# EAGLE design CircuitRiver - RPi-Basic Stream (EAGLE 7.5.0)
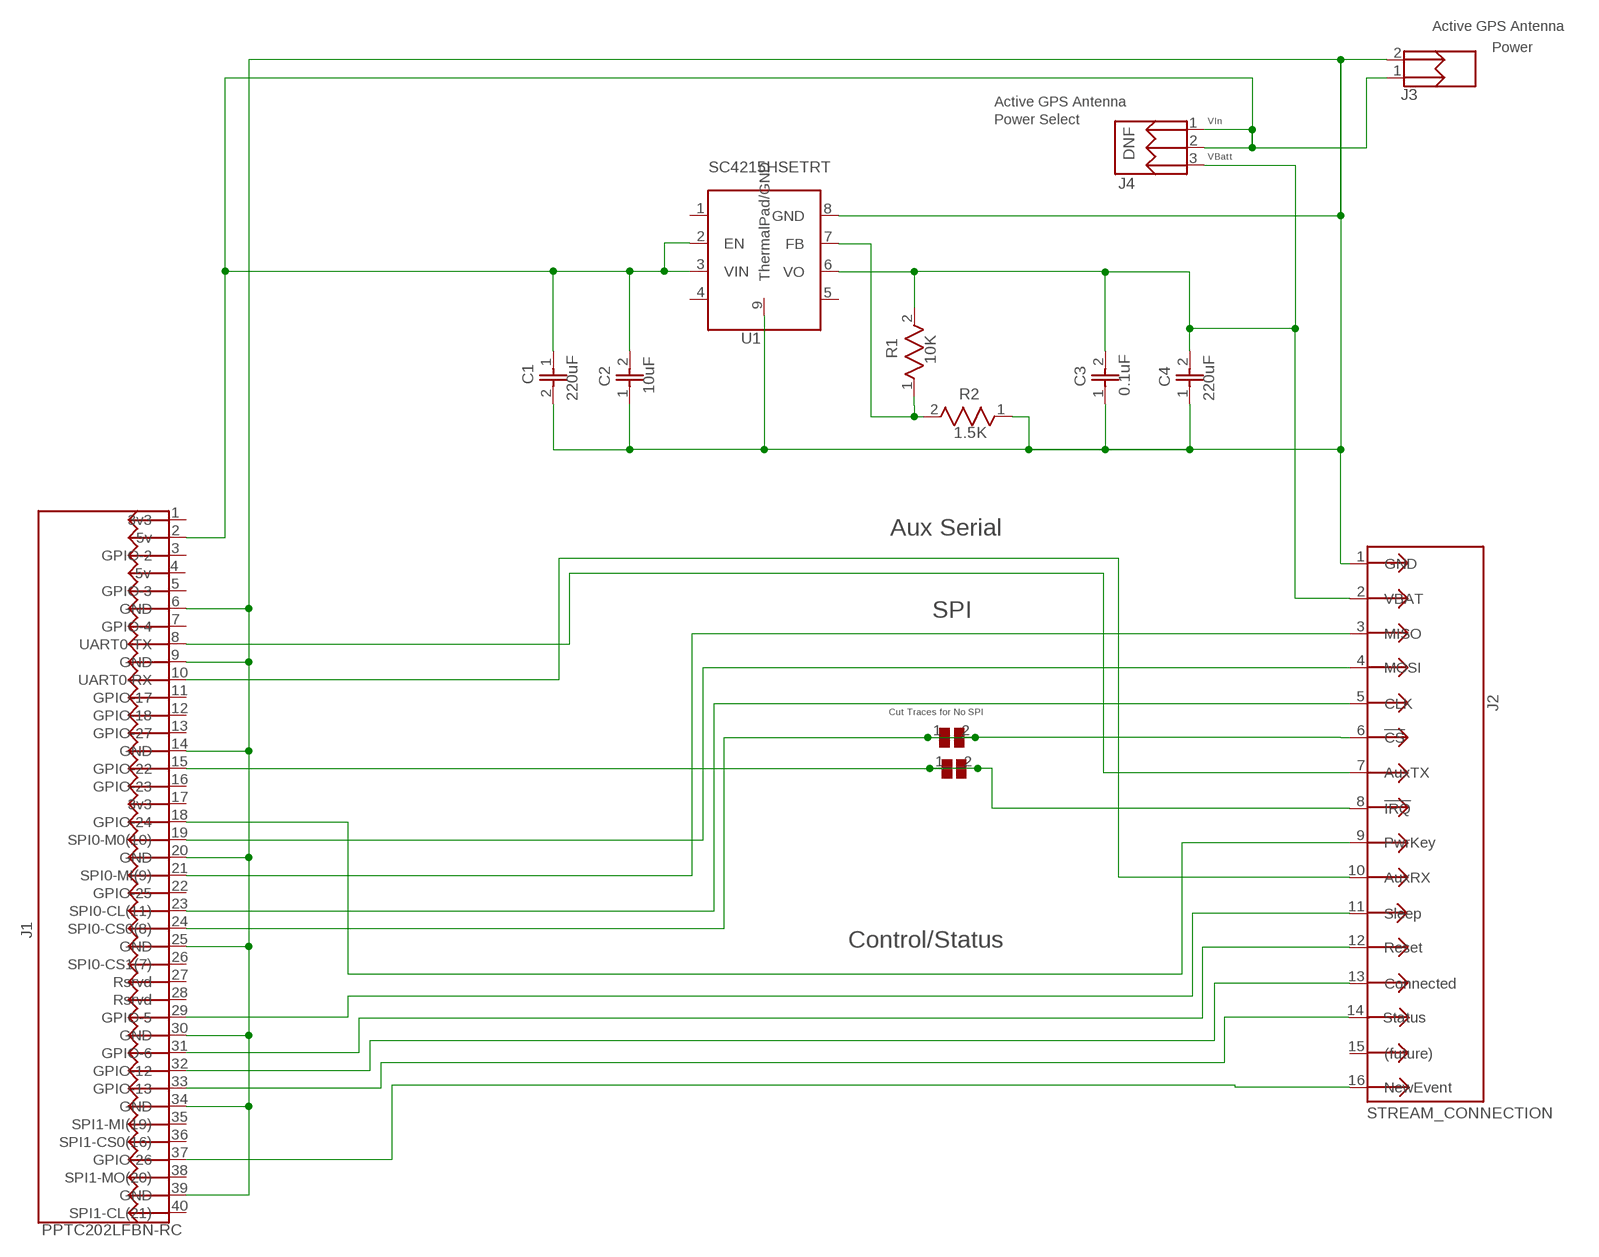
[diagram p0: schematic, sheet 1]

## Parts
C1  220uF  CAP_1206_NP  [CAP_1206]
C2  10uF  CAP_0603_NP  [CAP_0603]
C3  0.1uF  DEV_C3  [0402_NP]
C4  220uF  CAP_1206_NP  [CAP_1206]
J1  PPTC202LFBN-RC  R-PI_GPIO_HEADER  [HDR-2x20T/2.54x2.54/51x5]
J2  STREAM_CONNECTION  [HDR-2x8T/2x2/16x4]
J3  JST_PH-2_T/H  [JST_PH-2_T/H]
J4  DNF  3PIN_T/H_HEADER  [HDR-1x3T/2/6x2]
LG1  LOOUQ_LOGO  [LooUQ-6mm]
LG2  CIRCUITRIVER_LOGO  [CircuitRiver-6mm]
R1  10K  RES_0603  [RES_0603]
R2  1.5K  RES_0603  [RES_0603]
TJ1  NoMount  TRACE_JUMPER  [TraceJumper]
TJ2  NoMount  TRACE_JUMPER  [TraceJumper]
U1  SC4215HSETRT  SC4215H_LDO  [SOIC-8EP/150mil]

## Nets
GND: C1.2 C2.1 C3.1 C4.1 J1.6(GND) J1.9(GND) J1.14(GND) J1.20(GND) J1.25(GND) J1.30(GND) J1.34(GND) J1.39(GND) J2.1(GND) J3.2 R2.1 U1.8(GND) U1.9(ThermalPad/GND)
Net_2: R1.1 R2.2 U1.7(FB)
Net_4: J1.19(SPI0-M0(10)) J2.4(MOSI)
Net_5: J1.21(SPI0-MI(9)) J2.3(MISO)
Net_6: J1.23(SPI0-CL(11)) J2.5(CLK)
Net_7: J1.24(SPI0-CS0(8)) J2.6(!CS) TJ1.1 TJ1.2
Net_8: J1.31(GPIO-6) J2.12(Reset)
Net_9: J1.33(GPIO-13) J2.14(Status)
Net_10: J1.18(GPIO-24) J2.9(PwrKey)
Net_11: J1.15(GPIO-22) J2.8(!IRQ) TJ2.1 TJ2.2
Net_12: J1.8(UART0-TX) J2.7(AuxTX)
Net_13: J1.10(UART0-RX) J2.10(AuxRX)
Net_14: J1.29(GPIO-5) J2.11(Sleep)
Net_15: J1.32(GPIO-12) J2.13(Connected)
Net_16: J1.37(GPIO-26) J2.16(NewEvent)
Pwr5v0: C1.1 C2.2 J1.2(5v) J3.1 J4.1 J4.2 U1.2(EN) U1.3(VIN)
VBAT: C3.2 C4.2 J2.2(VBAT) J4.3 R1.2 U1.6(VO)
Unconnected: J1.1(3v3) J1.3(GPIO-2) J1.4(5v) J1.5(GPIO-3) J1.7(GPIO-4) J1.11(GPIO-17) J1.12(GPIO-18) J1.13(GPIO-27) J1.16(GPIO-23) J1.17(3v3) J1.22(GPIO-25) J1.26(SPI0-CS1(7)) J1.27(Rsrvd) J1.28(Rsrvd) J1.35(SPI1-MI(19)) J1.36(SPI1-CS0(16)) J1.38(SPI1-MO(20)) J1.40(SPI1-CL(21)) J2.15((future)) U1.1(NC) U1.4(NC) U1.5(NC)

## Notes on the sheet
- Active GPS Antenna
- Power
- Active GPS Antenna
- Power Select
- VIn
- VBatt
- Aux Serial
- SPI
- Cut Traces for No SPI
- Control/Status

## Library data of the parts
C1 C4 = common:CAP_1206_NP; DATASHEET: https://search.murata.co.jp/Ceramy/image/img/A01X/G101/ENG/GRM31CR60J227ME11-01.pdf; MANUFACTURER: Murata; MFGPARTNM: GRM31CR60J227ME11L
C2 = common:CAP_0603_NP; MANUFACTURER: Samsung; MFGPARTNM: CL10A106MQ8NNNC
C3 = common:DEV_C3; MANUFACTURER: Samsung; MFGPARTNM: CL10B104KB8NNNC
J1 = common:R-PI_GPIO_HEADER; ALT-DIGIKEYPARTNM: 1528-1385-ND; DATASHEET: https://drawings-pdf.s3.amazonaws.com/10492.pdf; DESCRIPTION: CONN HDR 40POS 0.1 TIN PCB; MANUFACTURER: Sullins; MFGPARTNM: PPTC202LFBN-RC
J2 = common:STREAM_CONNECTION; DATASHEET: https://cdn.harwin.com/pdfs/M22-204.pdf; MANUFACTURER: Harwin; MFGPARTNM: M22-2040805
J3 = common:JST_PH-2_T/H; DATASHEET: http://www.jst-mfg.com/product/pdf/eng/ePH.pdf; MANUFACTURER: JST; MFGPARTNM: S2B-PH-K-S(LF)(SN)
J4 = common:3PIN_T/H_HEADER; DATASHEET: https://media.digikey.com/pdf/Data%20Sheets/3M%20PDFs/951yyy-xx22-AR_Series%20Datasheet.pdf; MANUFACTURER: 3M; MFGPARTNM: 951103-8622-AR
LG1 = common:LOOUQ_LOGO
LG2 = common:CIRCUITRIVER_LOGO
R1 = common:RES_0603; MANUFACTURER: Stackpole; MFGPARTNM: RNCP0603FTD10K0
R2 = common:RES_0603; MANUFACTURER: Stackpole; MFGPARTNM: RNCP0603FTD10K0; VALUE: 10K
TJ1 TJ2 = common:TRACE_JUMPER; DESCRIPTION: Cutable trace jumper
U1 = common:SC4215H_LDO; DATASHEET: https://www.semtech.com/uploads/documents/sc4215a.pdf; DESCRIPTION: IC REG LINEAR POS ADJ 2A 8SOIC; MANUFACTURER: Semtech; MFGPARTNM: SC4215HSETRT

## Board
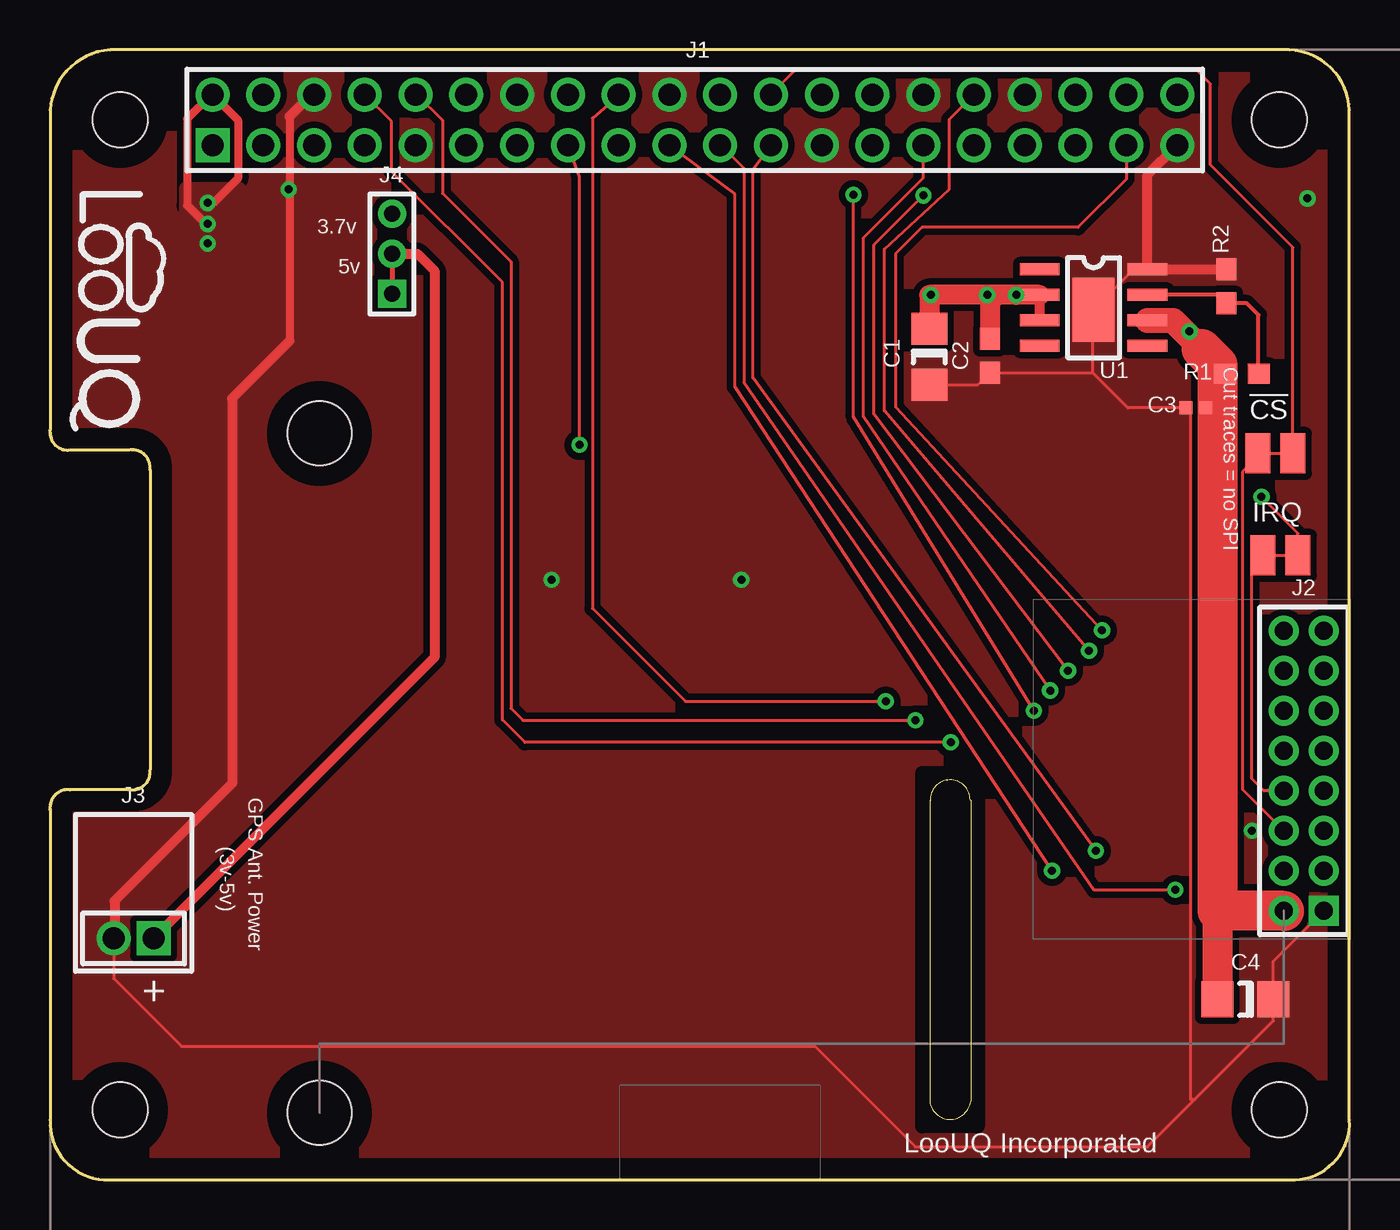
[diagram p1: board, top side]
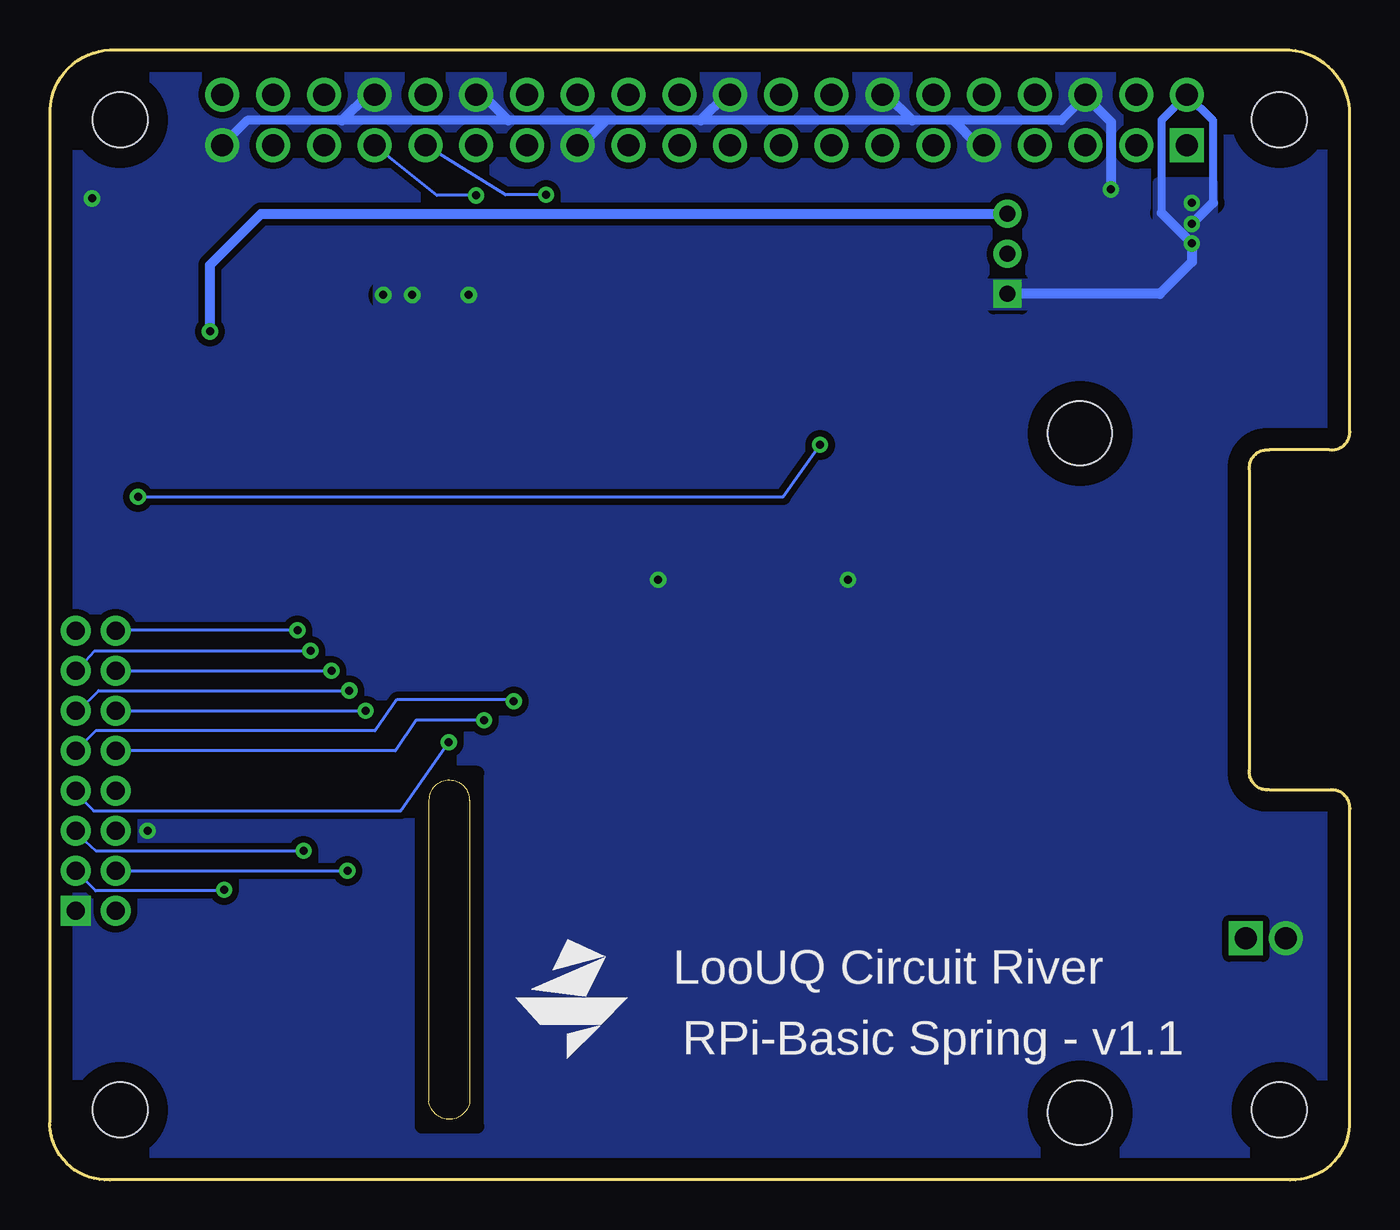
[diagram p2: board, bottom side, seen from below]

Size 65.01 x 56.5 mm. Coordinates in mm from the lower left corner, seen from the top.
Outline: 0.01,3 arc95 2.98,0 62.01,0 arc97 65.01,3 65.01,53.5 arc86 62.01,56.5 3.01,56.5 arc82 0.01,53.5 0.01,37.5 arc106 1.01,36.5 4.01,36.5 arc-103 5.01,35.5 5.01,20.5 arc-102 4.01,19.5 1.01,19.5 arc106 0.01,18.5 0.01,3
Copper layers (1*16): Top 0.035mm / dielectric 1.5mm / Bottom 0.035mm
Design rules "default *": minimum track width 10mil, minimum drill 0.61mm, track to track 8mil, track to pad 8mil, pad to pad 8mil, via to via 8mil, smd to smd 8mil, copper to edge 40mil, drill to drill 8mil, minimum pad ring 0mil, minimum via ring 8mil, stop-mask expansion 4mil, vias tented up to drill 16mil, thermal gap 10mil
Holes 3.2 mm at 13.48,3.35 13.48,37.33
Holes 2.75 mm at 61.51,53 3.51,53 3.51,3.5 61.51,3.5
tRestrict: 4 lines
bRestrict: 4 lines
Milling: 4 lines

### Footprints (pad centres in the part's own frame; a part is rotated, then mirrored left to right if it is on the bottom)
CAP_1206 = smd 1.6 x 1.8: 1 -1.4,0; 2 1.4,0
CAP_0603 = smd 1.1 x 1: 1 -0.85,0; 2 0.85,0
0402_NP = smd 0.65 x 0.65: 1 -0.48,0; 2 0.48,0
CAP_1206_C4 = smd 1.6 x 1.8: 1 -1.4,0; 2 1.4,0
HDR-2x20T/2.54x2.54/51x5 = drill 1.1 pad 1.7 square: 1 -24.13,-1.27 | drill 1.1 pad 1.7: 2 -24.13,1.27; 3 -21.59,-1.27; 4 -21.59,1.27; 5 -19.05,-1.27; 6 -19.05,1.27; 7 -16.51,-1.27; 8 -16.51,1.27; 9 -13.97,-1.27; 10 -13.97,1.27; 11 -11.43,-1.27; 12 -11.43,1.27; 13 -8.89,-1.27; 14 -8.89,1.27; 15 -6.35,-1.27; 16 -6.35,1.27; 17 -3.81,-1.27; 18 -3.81,1.27; 19 -1.27,-1.27; 20 -1.27,1.27; 21 1.27,-1.27; 22 1.27,1.27; 23 3.81,-1.27; 24 3.81,1.27; 25 6.35,-1.27; 26 6.35,1.27; 27 8.89,-1.27; 28 8.89,1.27; 29 11.43,-1.27; 30 11.43,1.27; 31 13.97,-1.27; 32 13.97,1.27; 33 16.51,-1.27; 34 16.51,1.27; 35 19.05,-1.27; 36 19.05,1.27; 37 21.59,-1.27; 38 21.59,1.27; 39 24.13,-1.27; 40 24.13,1.27
HDR-2x8T/2x2/16x4 = drill 0.9 pad 1.5 square: 1 -7,-1 | drill 0.9 pad 1.5: 2 -7,1; 3 -5,-1; 4 -5,1; 5 -3,-1; 6 -3,1; 7 -1,-1; 8 -1,1; 9 1,-1; 10 1,1; 11 3,-1; 12 3,1; 13 5,-1; 14 5,1; 15 7,-1; 16 7,1
JST_PH-2_T/H = drill 1.1 pad 1.7 square: 1 0,-1 | drill 1.1 pad 1.7: 2 0,1
HDR-1x3T/2/6x2 = drill 0.8 pad 1.4 square: 1 -2,0 | drill 0.8 pad 1.4: 2 0,0; 3 2,0
RES_0603 = smd 1.1 x 1: 1 -0.85,0; 2 0.85,0
TraceJumper = smd 1.25 x 2: 1 -0.875,0; 2 0.875,0
SOIC-8EP/150mil = smd 2 x 0.6: 1 -2.7,1.905; 2 -2.7,0.635; 3 -2.7,-0.635; 4 -2.7,-1.905; 5 2.7,-1.905; 6 2.7,-0.635; 7 2.7,0.635; 8 2.7,1.905 | smd 2.1 x 3.2: 9 0,-0.1

### Placement (x,y rotation side)
C1  43.98,41.15 270 top
C2  47.01,41.2 90 top
C3  57.31,38.6 0 top
C4  220uF  [CAP_1206_C4]  59.81,9.03 180 top
J1  R-PI GPIO HEADER  [HDR-2x20T/2.54x2.54/51x5]  32.26,53 0 top
J2  STREAM CONNECTION  [HDR-2x8T/2x2/16x4]  62.73,20.45 90 top
J3  JST PH-2 T/H  [JST_PH-2_T/H]  4.18,12.08 90 top
J4  17.11,46.3 90 top
Keepout_1  1  [ROUTE_KEEPOUT_1]  45.02,11.52 0 top
LG1  LOOUQ LOGO  [LooUQ-6mm]  3.35,43.43 270 top
LG2  CIRCUITRIVER LOGO  [CircuitRiver-6mm]  38.91,9.05 0 bottom
R1  59.63,40.3 180 top
R2  58.86,44.68 270 top
TJ1  61.31,36.33 0 top
TJ2  61.56,31.23 0 top
U1  52.21,43.62 0 top

### Tracks (layer width: path | path; a pad name or v marks a point on that pad's centre or on a via)
GND  (via drill 0.4 pad 0.8)
  Top 0.15: U1.8 54.21,45.53 U1.9 52.18,43.5 52.18,40.35 | C1.2 46.41,39.75 C2.1 52.18,40.35 | 52.18,40.35 53.93,38.6 C3.1 57.08,38.35 57.08,4 57.25,4 | J3.2 3.18,10.08 6.58,6.68 38.26,6.68 43.28,1.65 54.91,1.65 57.25,4 | 57.25,4 61.21,7.95 C4.1 61.21,10.93 J2.1
  Top 0.4: 11.98,53.18 11.98,49.53 | 11.98,49.53 11.98,41.95 | v11.93,49.53 11.98,49.53
  Top 0.5: J1.6 13.08,54.27 11.98,53.18 | 11.98,41.95 9.11,39.08 9.11,19.83 3.23,13.95 3.23,12.08 J3.2 | R2.1 U1.8 54.91,50.25 J1.39
  Bottom 0.45: J1.6 13.21,54.18 14.41,52.98 19.83,52.98 21.87,52.98 32.46,52.98 37.2,52.98 42.09,52.98 50.4,52.98 55.14,52.98 J1.39
  Bottom 0.5: J1.9 18.58,51.73 19.83,52.98 | J1.14 23.16,54.27 21.87,52.98 | J1.20 31.17,54.27 32.46,52.98 | J1.25 38.44,51.73 37.2,52.98 | J1.30 43.38,54.27 42.09,52.98 | J1.34 49.1,54.27 50.4,52.98 | J1.6 13.21,54.18 11.93,52.9 v11.93,49.53
  other vias: 34.58,30 25.08,30 62.91,49.08 60.13,17.45
  pour Top (isolate 0.33, no thermals): 0.99,3.05 1.04,2.44 1.22,1.96 1.53,1.54 1.95,1.23 2.43,1.04 3.03,0.98 61.97,0.98 62.58,1.03 63.07,1.22 63.48,1.53 63.79,1.94 63.98,2.43 64.03,3.04 64.03,53.42 63.94,53.99 63.73,54.48 63.4,54.89 62.98,55.22 62.49,55.43 61.93,55.53 3.1,55.53 2.55,55.42 2.06,55.2 1.64,54.87 1.31,54.45 1.09,53.96 0.99,53.41 0.99,37.51 0.99,37.48 1.01,37.48 4.03,37.48 4.46,37.46 4.99,37.28 5.45,36.94 5.78,36.49 5.97,35.96 5.99,35.52 5.99,20.48 5.97,20.05 5.78,19.52 5.45,19.07 4.99,18.73 4.47,18.54 4.03,18.53 1.01,18.53 0.99,18.52 0.99,18.5
  pour Bottom (isolate 0.33, no thermals): 0.99,3.05 1.04,2.44 1.22,1.96 1.53,1.54 1.95,1.23 2.43,1.04 3.03,0.98 61.97,0.98 62.58,1.03 63.07,1.22 63.48,1.53 63.79,1.94 63.98,2.43 64.03,3.04 64.03,53.42 63.94,53.99 63.73,54.48 63.4,54.89 62.98,55.22 62.49,55.43 61.93,55.53 3.1,55.53 2.55,55.42 2.06,55.2 1.64,54.87 1.31,54.45 1.09,53.96 0.99,53.41 0.99,37.51 0.99,37.48 1.01,37.48 4.03,37.48 4.46,37.46 4.99,37.28 5.45,36.94 5.78,36.49 5.97,35.96 5.99,35.52 5.99,20.48 5.97,20.05 5.78,19.52 5.45,19.07 4.99,18.73 4.47,18.54 4.03,18.53 1.01,18.53 0.99,18.52 0.99,18.5
  pour Top (isolate 0.33, no thermals): 51.18,46.08 51.2,41.17 53.27,41.17 53.27,46.06
  pour Top (isolate 0.33, no thermals): 63.28,13.94 64.22,13.94 64.22,11.97 63.28,11.97
Net_2
  Top 0.2: R1.1 60.46,40.3 60.46,43.25 59.88,43.83 R2.2 58.86,44.26 U1.7
Net_4  (via drill 0.4 pad 0.8)
  Top 0.15: v50.13,15.45 34.26,39.66 34.26,49.31 J1.19
  Bottom 0.15: J2.4 v50.13,15.45
Net_5  (via drill 0.4 pad 0.8)
  Top 0.15: J1.21 33.55,51.73 34.71,50.58 34.71,39.88 52.23,14.5 v56.29,14.5
  Bottom 0.15: v56.29,14.5 56.29,14.45 62.73,14.45 J2.3
Net_6  (via drill 0.4 pad 0.8)
  Top 0.15: v52.33,16.45 35.16,40.1 35.16,50.54 J1.23
  Bottom 0.15: J2.5 63.83,17.45 62.72,16.45 v52.33,16.45
Net_7
  Top 0.15: TJ1.2 TJ1.1 60.43,36.18 59.66,35.4 59.66,19.53 J2.6 | TJ1.2 | TJ1.2 62.18,46.63 58.06,50.75 58.06,54.8 57.41,55.45 37.25,55.45 J1.24
Net_8  (via drill 0.4 pad 0.8)
  Top 0.15: v49.21,23.45 40.2,38.17 v40.2,49.26
  Bottom 0.15: J2.12 v49.21,23.45 | v40.2,49.26 42.23,49.26 J1.31
Net_9  (via drill 0.4 pad 0.8)
  Top 0.15: v50.93,25.45 41.23,38.29 41.23,46.76 v43.7,49.23
  Bottom 0.15: J2.14 v50.93,25.45 | v43.7,49.23 45.65,49.23 J1.33
Net_10  (via drill 0.4 pad 0.8)
  Top 0.15: J1.18 28.45,54.21 27.13,53.1 27.13,28.58 31.78,23.93 v41.81,23.93
  Bottom 0.15: v41.81,23.93 41.81,24 47.66,24 48.75,22.45 62.73,22.45 J2.9
Net_11  (via drill 0.4 pad 0.8)
  Top 0.15: TJ2.2 TJ2.1 60.13,30.68 60.13,20.05 60.73,19.45 J2.8 | TJ2.2 | TJ2.2 62.43,32.33 v60.61,34.15 | v26.48,36.75 26.48,50.15 J1.15
  Bottom 0.15: v60.61,34.15 28.33,34.15 v26.48,36.75
Net_12  (via drill 0.4 pad 0.8)
  Top 0.15: v45.06,21.88 23.76,21.88 22.63,23 22.63,44.88 17.09,50.42 17.09,52.93 J1.8
  Bottom 0.15: J2.7 63.73,19.35 62.83,18.45 47.46,18.45 v45.06,21.88
Net_13  (via drill 0.4 pad 0.8)
  Top 0.15: J1.10 18.34,54.27 19.63,52.98 19.63,49.33 23.06,45.9 23.06,23.58 23.66,22.98 v43.29,22.98
  Bottom 0.15: v43.29,22.98 46.71,22.98 47.73,21.45 J2.10
Net_14  (via drill 0.4 pad 0.8)
  Top 0.15: v50.04,24.47 40.68,38.17 40.68,47.1 43.69,50.11 J1.29
  Bottom 0.15: J2.11 63.6,23.45 62.59,24.47 v50.04,24.47
Net_15  (via drill 0.4 pad 0.8)
  Top 0.15: v51.98,26.45 41.73,38.45 41.73,46.55 44.98,49.53 44.98,53.03 J1.32
  Bottom 0.15: J2.13 63.68,25.45 62.78,26.45 v51.98,26.45
Net_16  (via drill 0.4 pad 0.8)
  Top 0.15: J1.37 53.85,50.04 51.43,47.63 43.62,47.63 42.3,46.31 42.3,38.66 v52.63,27.48
  Bottom 0.15: v52.63,27.48 61.73,27.48 J2.16
Pwr5v0  (via drill 0.4 pad 0.8)
  Top 0.25: J4.2 J4.1
  Top 0.4: v7.88,48.85 8.18,48.85 9.41,50.08 9.41,52.99 J1.2 8.08,54.27 6.86,53.05 6.86,48.73 7.78,47.8 v7.88,47.8
  Top 0.5: U1.2 U1.3 | J4.2 18.38,46.3 19.23,45.45 19.23,26.13 J3.1
  Top 1: v48.33,44.26 U1.2 47.39,44.26 47.01,43.88 C2.2 | v48.33,44.26 46.93,44.26 | 46.93,44.26 43.98,44.26 | 43.98,44.26 C1.1 | v48.33,44.25 v48.33,44.26 | v46.88,44.25 46.93,44.26 | v44.06,44.25 43.98,44.26
  Bottom 0.4: 9.41,48.35 9.41,52.99 J1.2 6.83,52.98 6.83,48.85
  Bottom 0.5: J4.1 9.48,44.3 7.88,45.9 v7.88,46.83 9.41,48.35 | 6.83,48.85 v7.88,47.8
  pour Top (isolate 0.33, no thermals): 6.78,49.59 9.49,49.59 9.44,45.72 6.78,45.72
  pour Bottom (isolate 0.33, no thermals): 6.9,49.84 9.54,49.84 9.54,45.08 9.56,44.96 9.63,44.85 9.74,44.78 9.86,44.76 48.54,44.76 48.54,43.8 6.9,43.77
VBAT  (via drill 0.4 pad 0.8)
  Top 0.5: v57.01,42.43 57.61,41.55 | R1.2 58.41,40.3 | C3.2 58.41,38.68
  Top 1.25: U1.6 56.17,42.99 57.61,41.55
  Top 1.5: 58.41,13.45 C4.2
  Top 2: 57.61,41.55 58.41,40.75 58.41,40.3 58.41,38.68 58.41,13.45 | J2.2 58.41,13.45 | 58.41,13.45
  Bottom 0.5: v57.01,42.43 57.01,45.75 54.46,48.3 J4.3

### Text on the board
tPlace: 3.7v | 5v | Cut traces = no SPI | !CS | IRQ | GPS Ant. Power | (3v-5v) | + | LooUQ Incorporated
bPlace: LooUQ Circuit River | RPi-Basic Spring - v1.1
tDocu: Rsrvd | Display Flex Cutout | Keep Out | Assembly | Camera Flex Cutout | LTEm1 USB